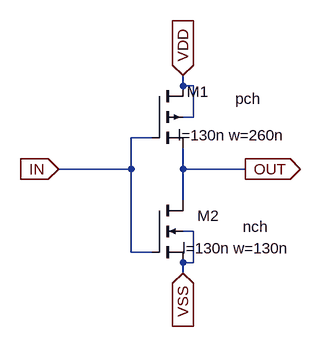
[diagram p0: schematic Inverter2.asc]
Inverter2.asc, the LTspice schematic file:
Version 4.1
SHEET 1 880 680
WIRE 160 -64 160 -80
WIRE 176 -64 160 -64
WIRE 176 -16 176 -64
WIRE 176 -16 160 -16
WIRE 112 16 80 16
WIRE 80 64 80 16
WIRE 80 64 -32 64
WIRE 160 64 160 32
WIRE 256 64 160 64
WIRE 160 112 160 64
WIRE 176 160 160 160
WIRE 80 192 80 64
WIRE 112 192 80 192
WIRE 176 208 176 160
WIRE 176 208 160 208
WIRE 160 224 160 208
FLAG -32 64 IN
IOPIN -32 64 In
FLAG 160 -80 VDD
IOPIN 160 -80 In
FLAG 160 224 VSS
IOPIN 160 224 In
FLAG 256 64 OUT
IOPIN 256 64 Out
SYMBOL pmos4 112 -64 R0
WINDOW 0 88 9 Right 2
WINDOW 3 168 20 Right 2
WINDOW 123 206 76 Right 2
SYMATTR InstName M1
SYMATTR Value pch
SYMATTR Value2 l=130n w=260n
SYMBOL nmos4 112 112 R0
WINDOW 0 104 24 Right 2
WINDOW 3 179 41 Right 2
WINDOW 123 213 74 Right 2
SYMATTR InstName M2
SYMATTR Value nch
SYMATTR Value2 l=130n w=130n

The netlist it stands for:
* Inverter2.asc
M1 VDD IN OUT VDD pch l=130n w=260n
M2 OUT IN VSS VSS nch l=130n w=130n
.model NMOS NMOS
.model PMOS PMOS
.lib standard.mos
.backanno
.end